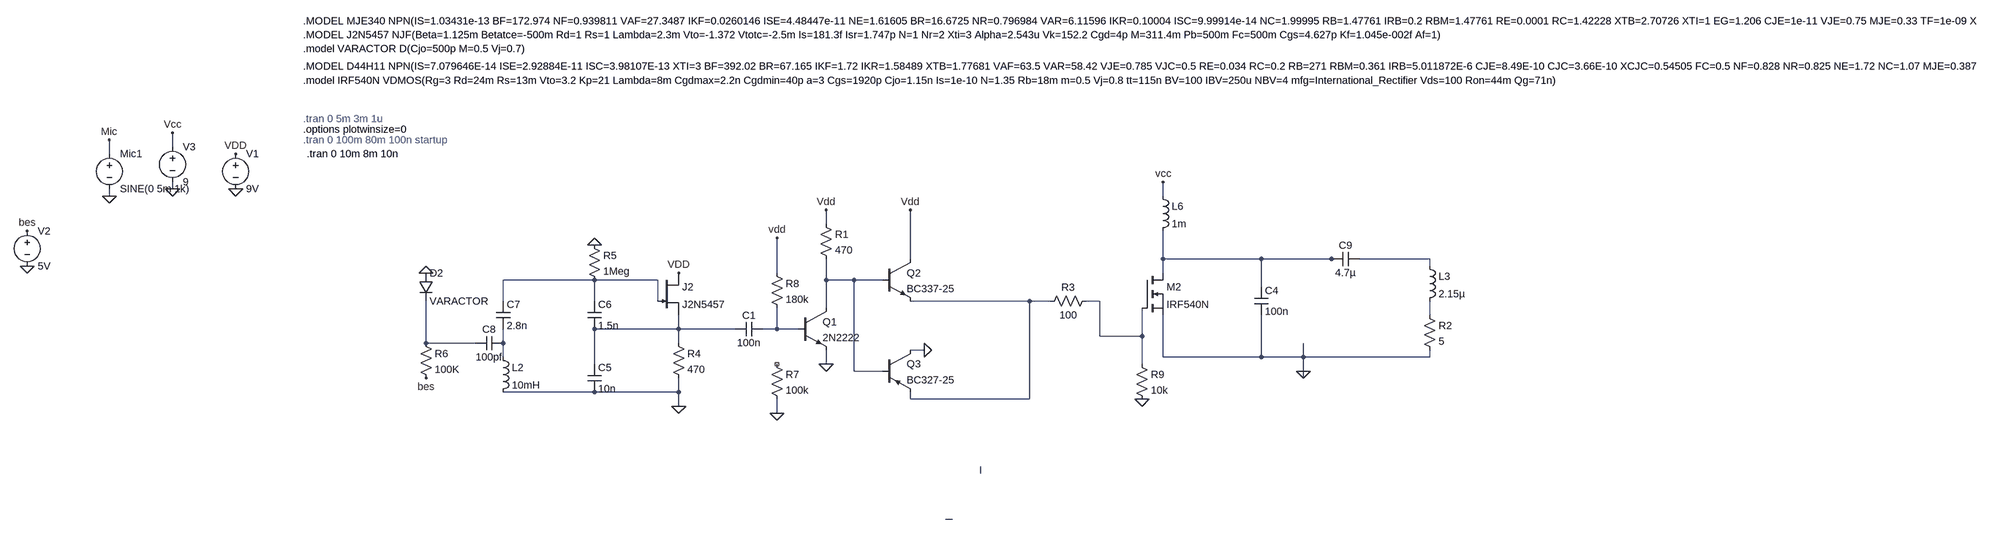
[diagram p0: schematic TTE Low-Frequency Transmitter.asc]
TTE Low-Frequency Transmitter.asc, the LTspice schematic file:
Version 4.1
SHEET 1 9024 2660
WIRE -208 368 -208 336
WIRE -352 384 -352 352
WIRE -208 464 -208 448
WIRE -352 480 -352 464
WIRE 2160 480 2160 448
WIRE 1392 544 1392 512
WIRE 1584 624 1584 512
WIRE 2160 624 2160 560
WIRE 2384 624 2160 624
WIRE 2544 624 2384 624
WIRE 2560 624 2544 624
WIRE 2768 624 2608 624
WIRE 2768 640 2768 624
WIRE 1280 656 1280 576
WIRE 2160 656 2160 624
WIRE 864 672 656 672
WIRE 1008 672 864 672
WIRE 1392 672 1392 624
WIRE 1456 672 1392 672
WIRE 1520 672 1456 672
WIRE 2384 688 2384 624
WIRE 656 720 656 672
WIRE 864 720 864 672
WIRE 1008 720 1008 672
WIRE 1856 720 1584 720
WIRE 1904 720 1856 720
WIRE 2016 720 1984 720
WIRE 1392 736 1392 672
WIRE 2768 752 2768 720
WIRE 1056 784 1056 752
WIRE 1056 784 864 784
WIRE 1184 784 1056 784
WIRE 1280 784 1280 736
WIRE 1280 784 1248 784
WIRE 1328 784 1280 784
WIRE 2016 800 2016 720
WIRE 2112 800 2112 736
WIRE 2112 800 2016 800
WIRE 480 816 480 720
WIRE 592 816 480 816
WIRE 656 816 656 784
WIRE 1056 816 1056 784
WIRE 1616 832 1584 832
WIRE 656 848 656 816
WIRE 2160 848 2160 752
WIRE 2384 848 2384 752
WIRE 2384 848 2160 848
WIRE 2480 848 2480 816
WIRE 2480 848 2384 848
WIRE 2768 848 2768 832
WIRE 2768 848 2480 848
WIRE 864 864 864 784
WIRE 1392 864 1392 832
WIRE 2112 864 2112 800
WIRE 1456 880 1456 672
WIRE 1520 880 1456 880
WIRE 2480 880 2480 848
WIRE 2480 896 2480 880
WIRE 864 928 656 928
WIRE 1056 928 1056 896
WIRE 1056 928 864 928
WIRE 1584 944 1584 928
WIRE 1856 944 1856 720
WIRE 1856 944 1584 944
WIRE 1056 960 1056 928
WIRE 1280 976 1280 944
WIRE 1744 1504 1744 1488
WIRE 1680 1872 1664 1872
FLAG -64 384 VDD
FLAG -64 464 0
FLAG -1216 640 0
FLAG -1216 560 bes
FLAG 1056 960 0
FLAG 1056 656 VDD
FLAG 864 592 0
FLAG 480 656 0
FLAG 480 896 bes
FLAG -208 464 0
FLAG -208 336 Vcc
FLAG 2160 448 vcc
FLAG 2480 880 0
FLAG 1392 512 Vdd
FLAG 1392 864 0
FLAG 1616 832 0
FLAG 1584 512 Vdd
FLAG -352 480 0
FLAG -352 352 Mic
FLAG 1280 976 0
FLAG 1280 576 vdd
FLAG 2112 944 0
SYMBOL voltage -64 368 R0
WINDOW 123 0 0 Left 0
WINDOW 39 0 0 Left 0
SYMATTR InstName V1
SYMATTR Value 9V
SYMBOL voltage -1216 544 R0
WINDOW 123 0 0 Left 0
WINDOW 39 0 0 Left 0
SYMATTR InstName V2
SYMATTR Value 5V
SYMBOL njf 1008 656 R0
SYMATTR InstName J2
SYMATTR Value J2N5457
SYMBOL res 1040 800 R0
SYMATTR InstName R4
SYMATTR Value 470
SYMBOL cap 848 864 R0
SYMATTR InstName C5
SYMATTR Value 10n
SYMBOL cap 848 720 R0
SYMATTR InstName C6
SYMATTR Value 1.5n
SYMBOL cap 640 720 R0
SYMATTR InstName C7
SYMATTR Value 2.8n
SYMBOL ind 640 832 R0
SYMATTR InstName L2
SYMATTR Value 10mH
SYMATTR SpiceLine Rser=1m
SYMBOL res 848 576 R0
SYMATTR InstName R5
SYMATTR Value 1Meg
SYMBOL diode 464 656 R0
SYMATTR InstName D2
SYMATTR Value VARACTOR
SYMBOL cap 656 800 R90
WINDOW 0 0 32 VBottom 2
WINDOW 3 32 32 VTop 2
SYMATTR InstName C8
SYMATTR Value 100pf
SYMBOL res 464 800 R0
SYMATTR InstName R6
SYMATTR Value 100K
SYMBOL voltage -208 352 R0
SYMATTR InstName V3
SYMATTR Value 9
SYMBOL nmos 2112 656 R0
SYMATTR InstName M2
SYMATTR Value IRF540N
SYMBOL cap 2368 688 R0
SYMATTR InstName C4
SYMATTR Value 100n
SYMBOL cap 2608 608 R90
WINDOW 0 0 32 VBottom 2
WINDOW 3 32 32 VTop 2
SYMATTR InstName C9
SYMATTR Value 4.7µ
SYMBOL ind 2144 464 R0
SYMATTR InstName L6
SYMATTR Value 1m
SYMBOL npn 1328 736 R0
SYMATTR InstName Q1
SYMATTR Value 2N2222
SYMBOL npn 1520 624 R0
SYMATTR InstName Q2
SYMATTR Value BC337-25
SYMBOL pnp 1520 832 R0
SYMATTR InstName Q3
SYMATTR Value BC327-25
SYMBOL res 1376 528 R0
SYMATTR InstName R1
SYMATTR Value 470
SYMBOL res 2000 704 R90
WINDOW 0 0 56 VBottom 2
WINDOW 3 32 56 VTop 2
SYMATTR InstName R3
SYMATTR Value 100
SYMBOL ind 2752 624 R0
SYMATTR InstName L3
SYMATTR Value 2.15µ
SYMATTR SpiceLine Rser=1m
SYMBOL res 2752 736 R0
SYMATTR InstName R2
SYMATTR Value 5
SYMBOL voltage -352 368 R0
WINDOW 123 0 0 Left 0
WINDOW 39 0 0 Left 0
SYMATTR InstName Mic1
SYMATTR Value SINE(0 5m 1k)
SYMBOL cap 1248 768 R90
WINDOW 0 0 32 VBottom 2
WINDOW 3 32 32 VTop 2
SYMATTR InstName C1
SYMATTR Value 100n
SYMBOL res 1264 848 R0
SYMATTR InstName R7
SYMATTR Value 100k
SYMBOL res 1264 640 R0
SYMATTR InstName R8
SYMATTR Value 180k
SYMBOL res 2096 848 R0
SYMATTR InstName R9
SYMATTR Value 10k
TEXT 200 112 Left 2 !.MODEL J2N5457 NJF(Beta=1.125m Betatce=-500m Rd=1 Rs=1 Lambda=2.3m Vto=-1.372 Vtotc=-2.5m Is=181.3f Isr=1.747p N=1 Nr=2 Xti=3 Alpha=2.543u Vk=152.2 Cgd=4p M=311.4m Pb=500m Fc=500m Cgs=4.627p Kf=1.045e-002f Af=1)
TEXT 200 144 Left 2 !.model VARACTOR D(Cjo=500p M=0.5 Vj=0.7)
TEXT 200 184 Left 2 !.MODEL D44H11 NPN(IS=7.079646E-14 ISE=2.92884E-11 ISC=3.98107E-13 XTI=3 BF=392.02 BR=67.165 IKF=1.72 IKR=1.58489 XTB=1.77681 VAF=63.5 VAR=58.42 VJE=0.785 VJC=0.5 RE=0.034 RC=0.2 RB=271 RBM=0.361 IRB=5.011872E-6 CJE=8.49E-10 CJC=3.66E-10 XCJC=0.54505 FC=0.5 NF=0.828 NR=0.825 NE=1.72 NC=1.07 MJE=0.387 MJC=0.352 EG=0.958 VCEO=80 ICRATING=10 MFG=FAIRCHILD)
TEXT 200 352 Left 2 ;.tran 0 100m 80m 100n startup
TEXT 200 80 Left 2 !.MODEL MJE340 NPN(IS=1.03431e-13 BF=172.974 NF=0.939811 VAF=27.3487 IKF=0.0260146 ISE=4.48447e-11 NE=1.61605 BR=16.6725 NR=0.796984 VAR=6.11596 IKR=0.10004 ISC=9.99914e-14 NC=1.99995 RB=1.47761 IRB=0.2 RBM=1.47761 RE=0.0001 RC=1.42228 XTB=2.70726 XTI=1 EG=1.206 CJE=1e-11 VJE=0.75 MJE=0.33 TF=1e-09 XTF=1 VTF=10 ITF=0.01 CJC=1e-11 VJC=0.75 MJC=0.33 XCJC=0.9 FC=0.5 CJS=0 VJS=0.75 MJS=0.5 TR=1e-07 PTF=0 Vceo=300 Icrating=0.5A mfg=OnSemi)
TEXT 200 216 Left 2 !.model IRF540N VDMOS(Rg=3 Rd=24m Rs=13m Vto=3.2 Kp=21 Lambda=8m Cgdmax=2.2n Cgdmin=40p a=3 Cgs=1920p Cjo=1.15n Is=1e-10 N=1.35 Rb=18m m=0.5 Vj=0.8 tt=115n BV=100 IBV=250u NBV=4 mfg=International_Rectifier Vds=100 Ron=44m Qg=71n)
TEXT 200 304 Left 2 ;.tran 0 5m 3m 1u
TEXT 200 328 Left 2 !.options plotwinsize=0
TEXT 208 384 Left 2 !.tran 0 10m 8m 10n

The netlist it stands for:
* TTE Low-Frequency Transmitter.asc
V1 VDD 0 9V
V2 bes 0 5V
J2 VDD N003 N008 J2N5457
R4 N008 0 470
C5 N008 0 10n
C6 N003 N008 1.5n
C7 N003 N011 2.8n
L2 N011 0 10mH Rser=1m
R5 0 N003 1Meg
D2 0 N010 VARACTOR
C8 N011 N010 100pf
R6 N010 bes 100K
V3 Vcc 0 9
M2 N001 N006 0 0 IRF540N
C4 N001 0 100n
C9 N002 N001 4.7µ
L6 Vcc N001 1m
Q1 N004 N009 0 0 2N2222
Q2 VDD N004 N005 0 BC337-25
Q3 0 N004 N005 0 BC327-25
R1 VDD N004 470
R3 N006 N005 100
L3 N002 N007 2.15µ Rser=1m
R2 N007 0 5
V§Mic1 Mic 0 SINE(0 5m 1k)
C1 N009 N008 100n
R7 NC_01 0 100k
R8 VDD N009 180k
R9 N006 0 10k
.model D D
.lib standard.dio
.model NPN NPN
.model PNP PNP
.lib standard.bjt
.model NJF NJF
.model PJF PJF
.lib standard.jft
.model NMOS NMOS
.model PMOS PMOS
.lib standard.mos
.MODEL J2N5457 NJF(Beta=1.125m Betatce=-500m Rd=1 Rs=1 Lambda=2.3m Vto=-1.372 Vtotc=-2.5m Is=181.3f Isr=1.747p N=1 Nr=2 Xti=3 Alpha=2.543u Vk=152.2 Cgd=4p M=311.4m Pb=500m Fc=500m Cgs=4.627p Kf=1.045e-002f Af=1)
.model VARACTOR D(Cjo=500p M=0.5 Vj=0.7)
.MODEL D44H11 NPN(IS=7.079646E-14 ISE=2.92884E-11 ISC=3.98107E-13 XTI=3 BF=392.02 BR=67.165 IKF=1.72 IKR=1.58489 XTB=1.77681 VAF=63.5 VAR=58.42 VJE=0.785 VJC=0.5 RE=0.034 RC=0.2 RB=271 RBM=0.361 IRB=5.011872E-6 CJE=8.49E-10 CJC=3.66E-10 XCJC=0.54505 FC=0.5 NF=0.828 NR=0.825 NE=1.72 NC=1.07 MJE=0.387 MJC=0.352 EG=0.958 VCEO=80 ICRATING=10 MFG=FAIRCHILD)
* .tran 0 100m 80m 100n startup
.MODEL MJE340 NPN(IS=1.03431e-13 BF=172.974 NF=0.939811 VAF=27.3487 IKF=0.0260146 ISE=4.48447e-11 NE=1.61605 BR=16.6725 NR=0.796984 VAR=6.11596 IKR=0.10004 ISC=9.99914e-14 NC=1.99995 RB=1.47761 IRB=0.2 RBM=1.47761 RE=0.0001 RC=1.42228 XTB=2.70726 XTI=1 EG=1.206 CJE=1e-11 VJE=0.75 MJE=0.33 TF=1e-09 XTF=1 VTF=10 ITF=0.01 CJC=1e-11 VJC=0.75 MJC=0.33 XCJC=0.9 FC=0.5 CJS=0 VJS=0.75 MJS=0.5 TR=1e-07 PTF=0 Vceo=300 Icrating=0.5A mfg=OnSemi)
.model IRF540N VDMOS(Rg=3 Rd=24m Rs=13m Vto=3.2 Kp=21 Lambda=8m Cgdmax=2.2n Cgdmin=40p a=3 Cgs=1920p Cjo=1.15n Is=1e-10 N=1.35 Rb=18m m=0.5 Vj=0.8 tt=115n BV=100 IBV=250u NBV=4 mfg=International_Rectifier Vds=100 Ron=44m Qg=71n)
* .tran 0 5m 3m 1u
.options plotwinsize=0
.tran 0 10m 8m 10n
.backanno
.end